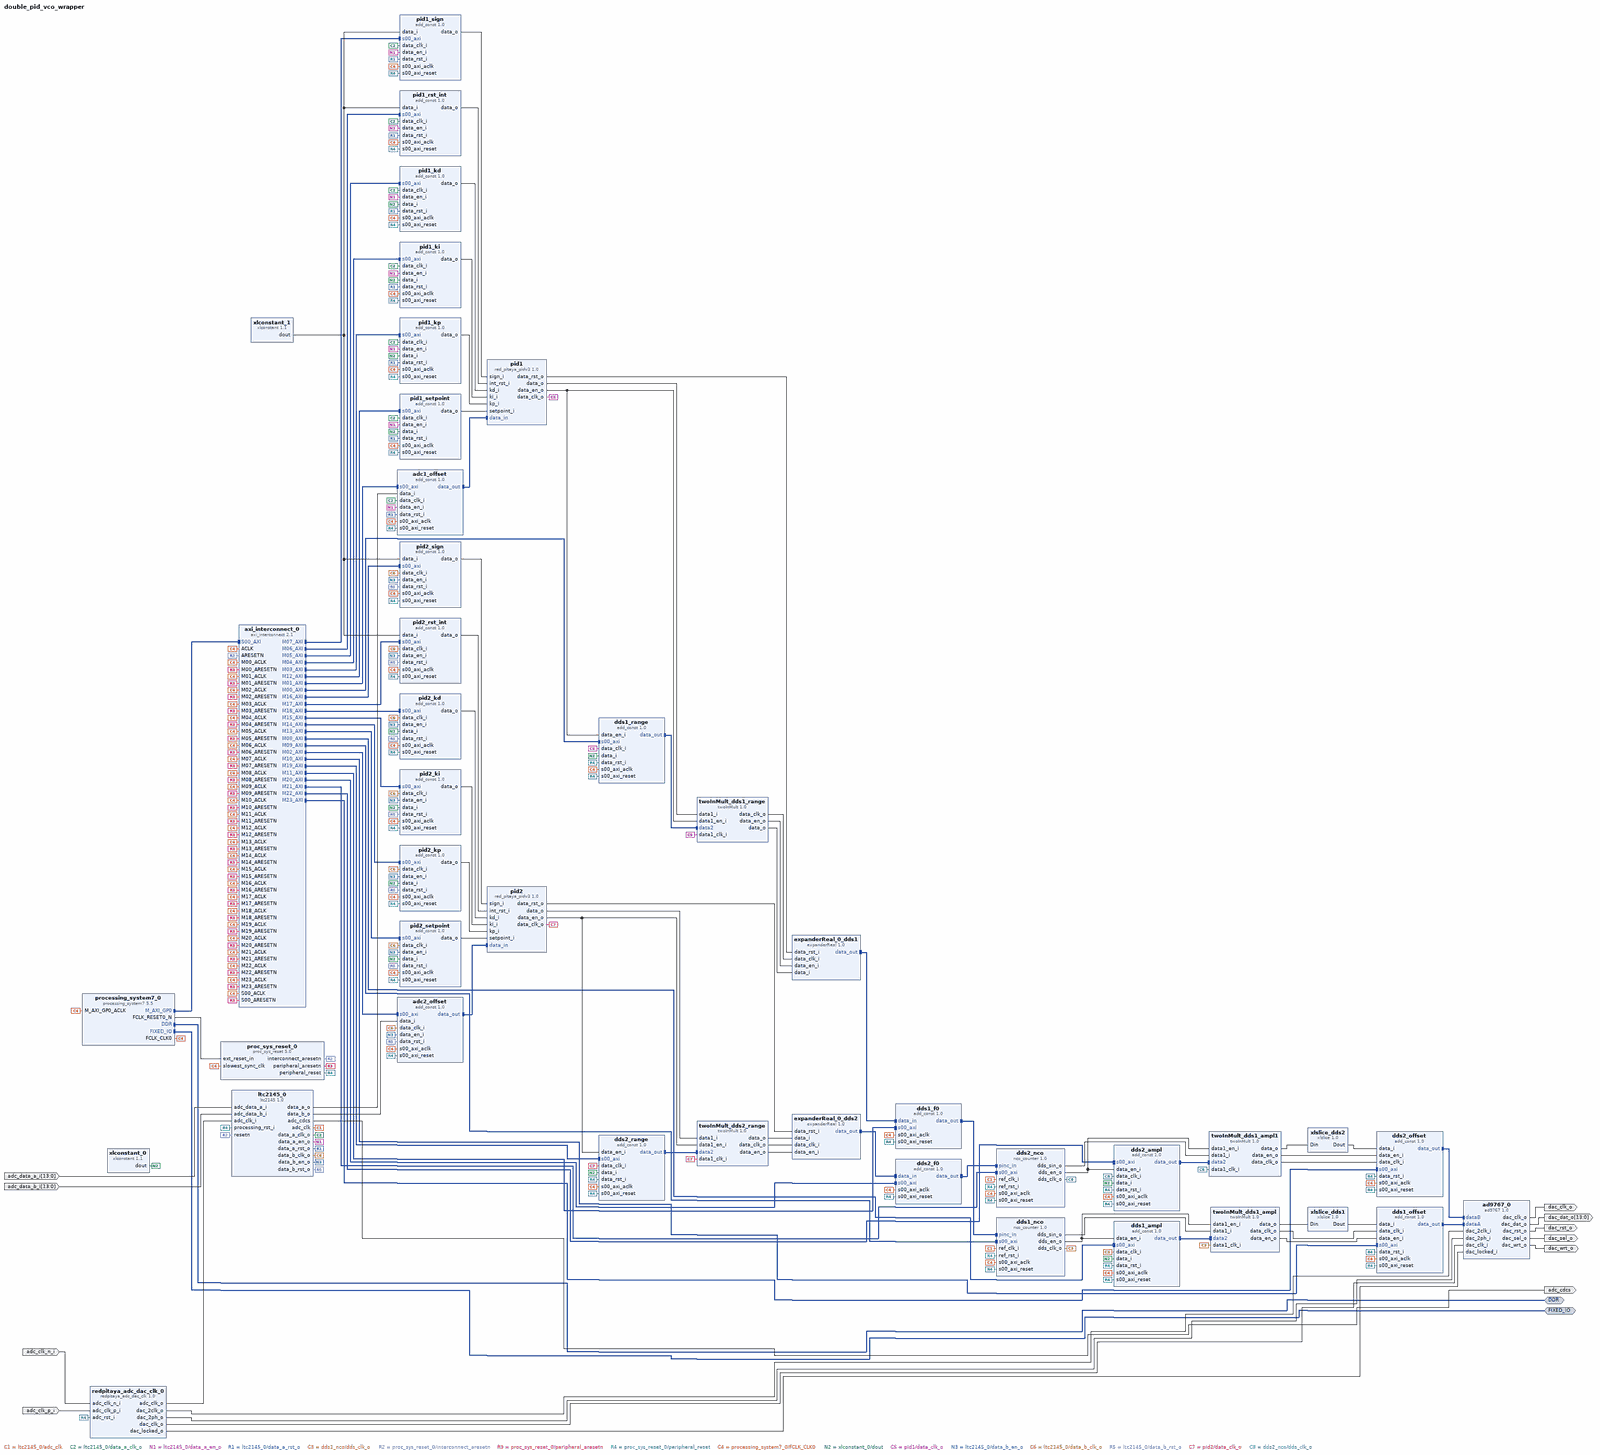
[diagram p0: block diagram of the top level, whole]
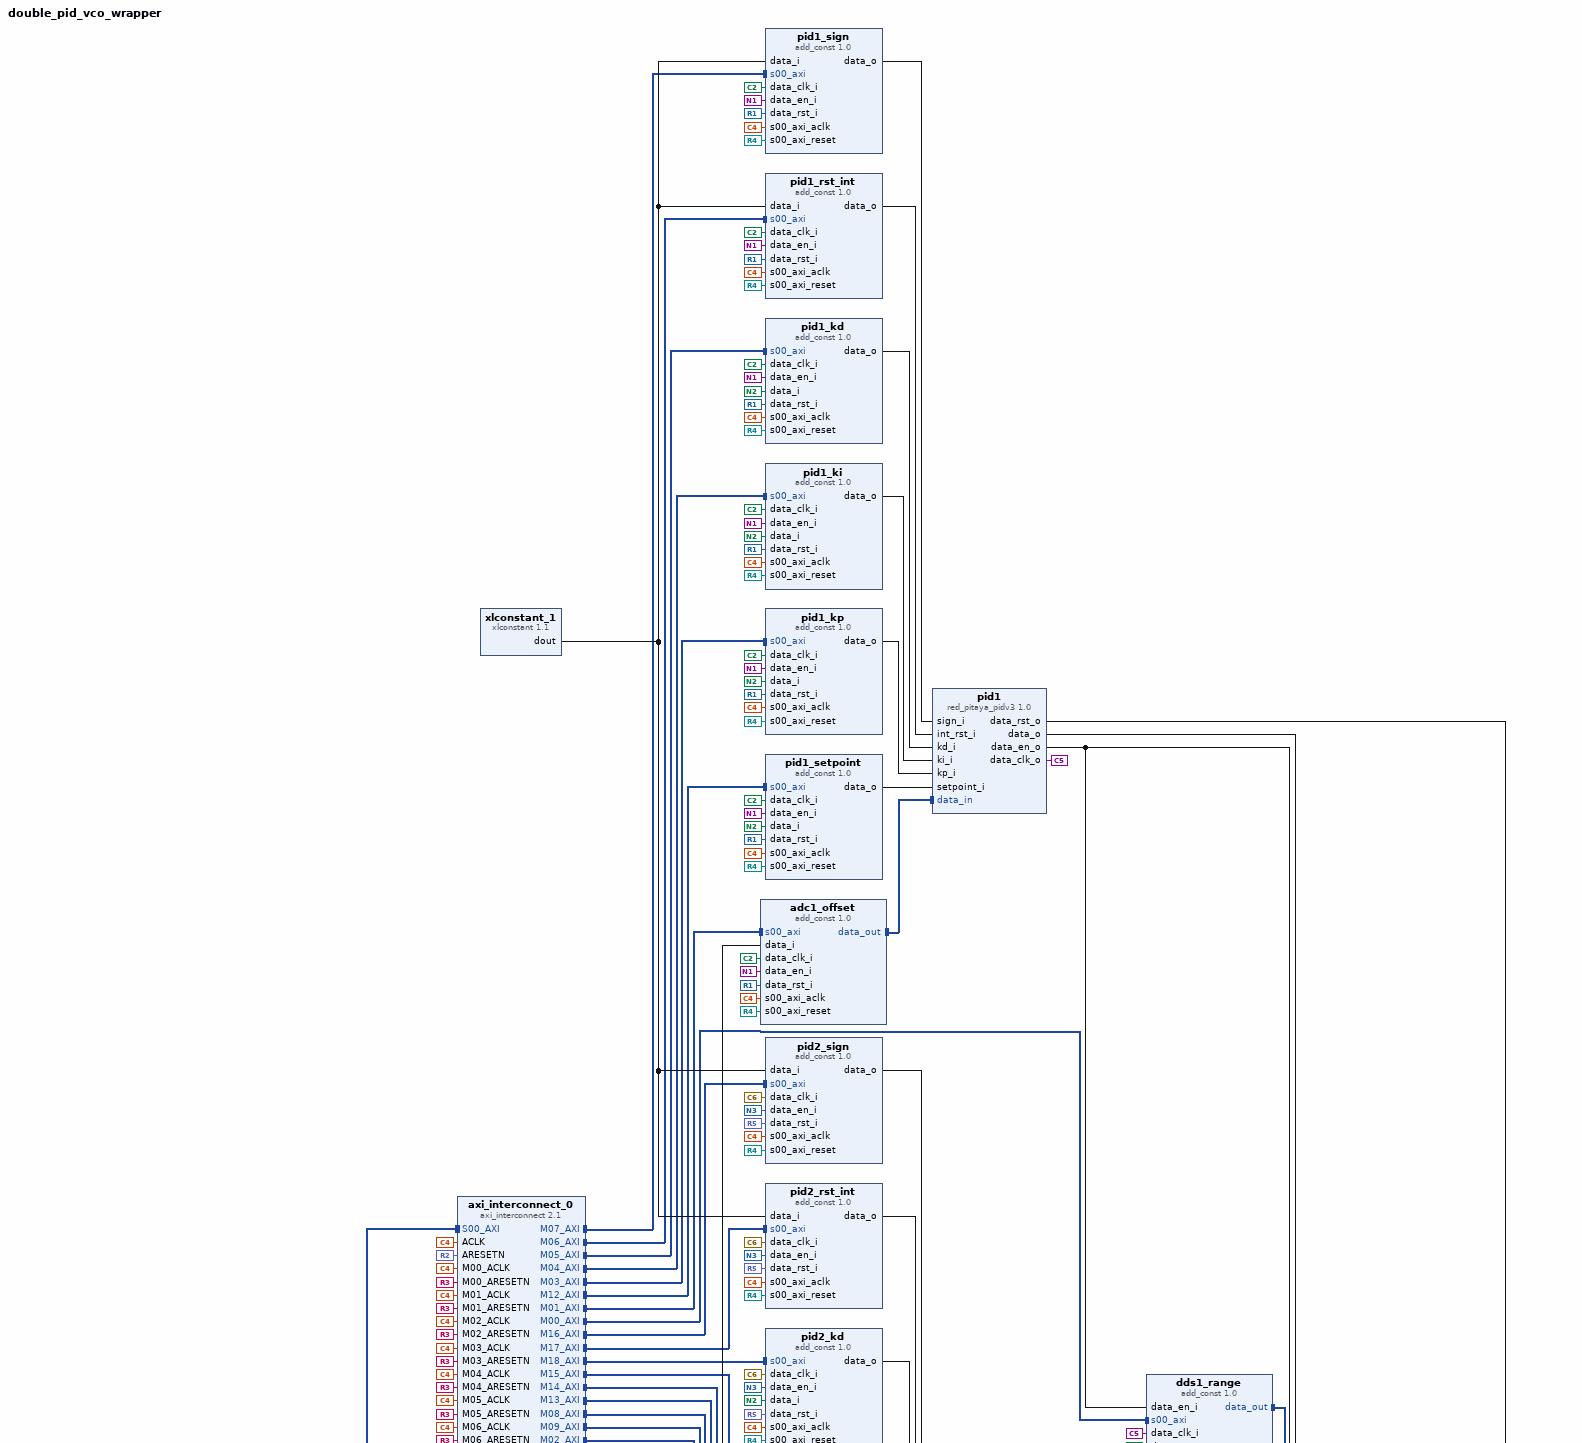
[diagram p1: block diagram of the top level, upper left part]
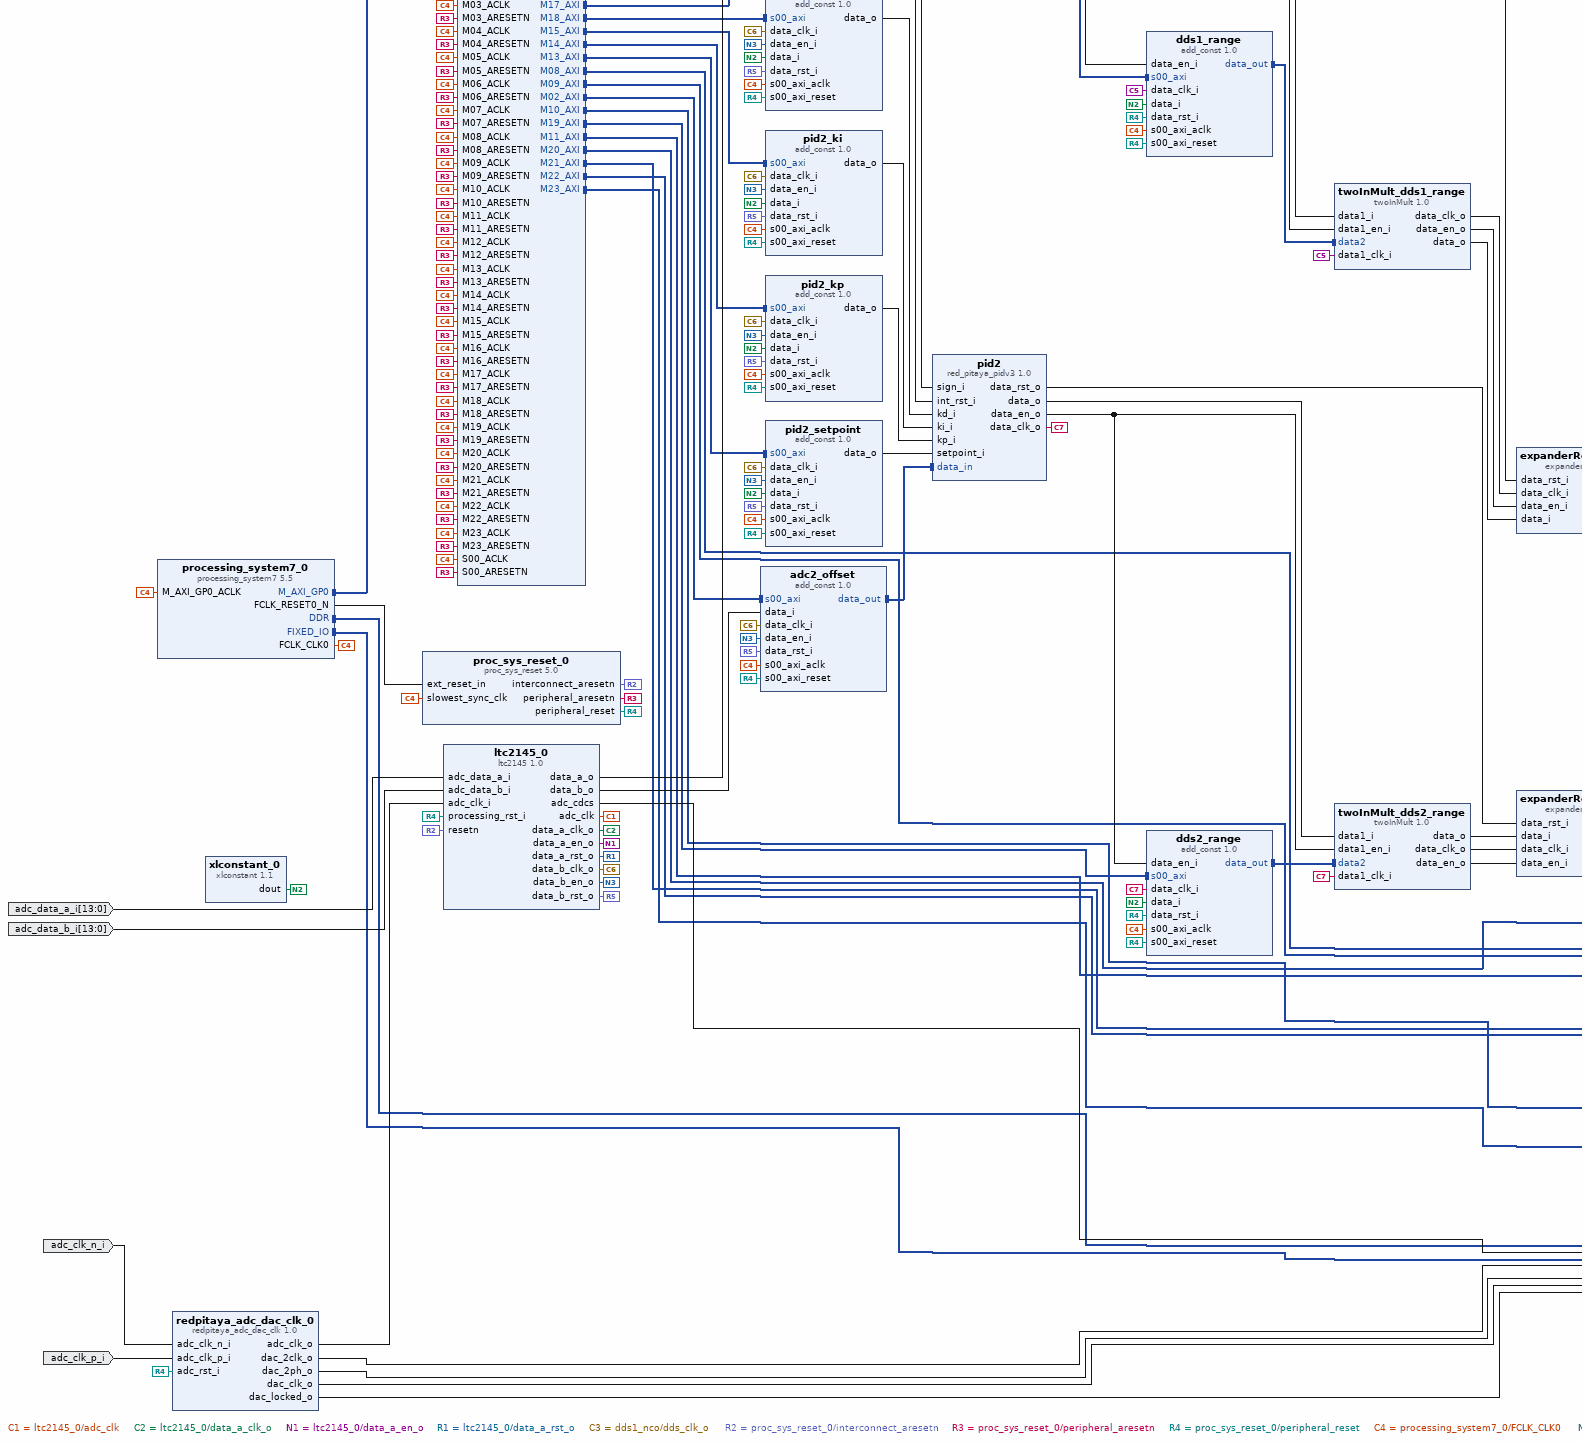
[diagram p2: block diagram of the top level, lower left part]
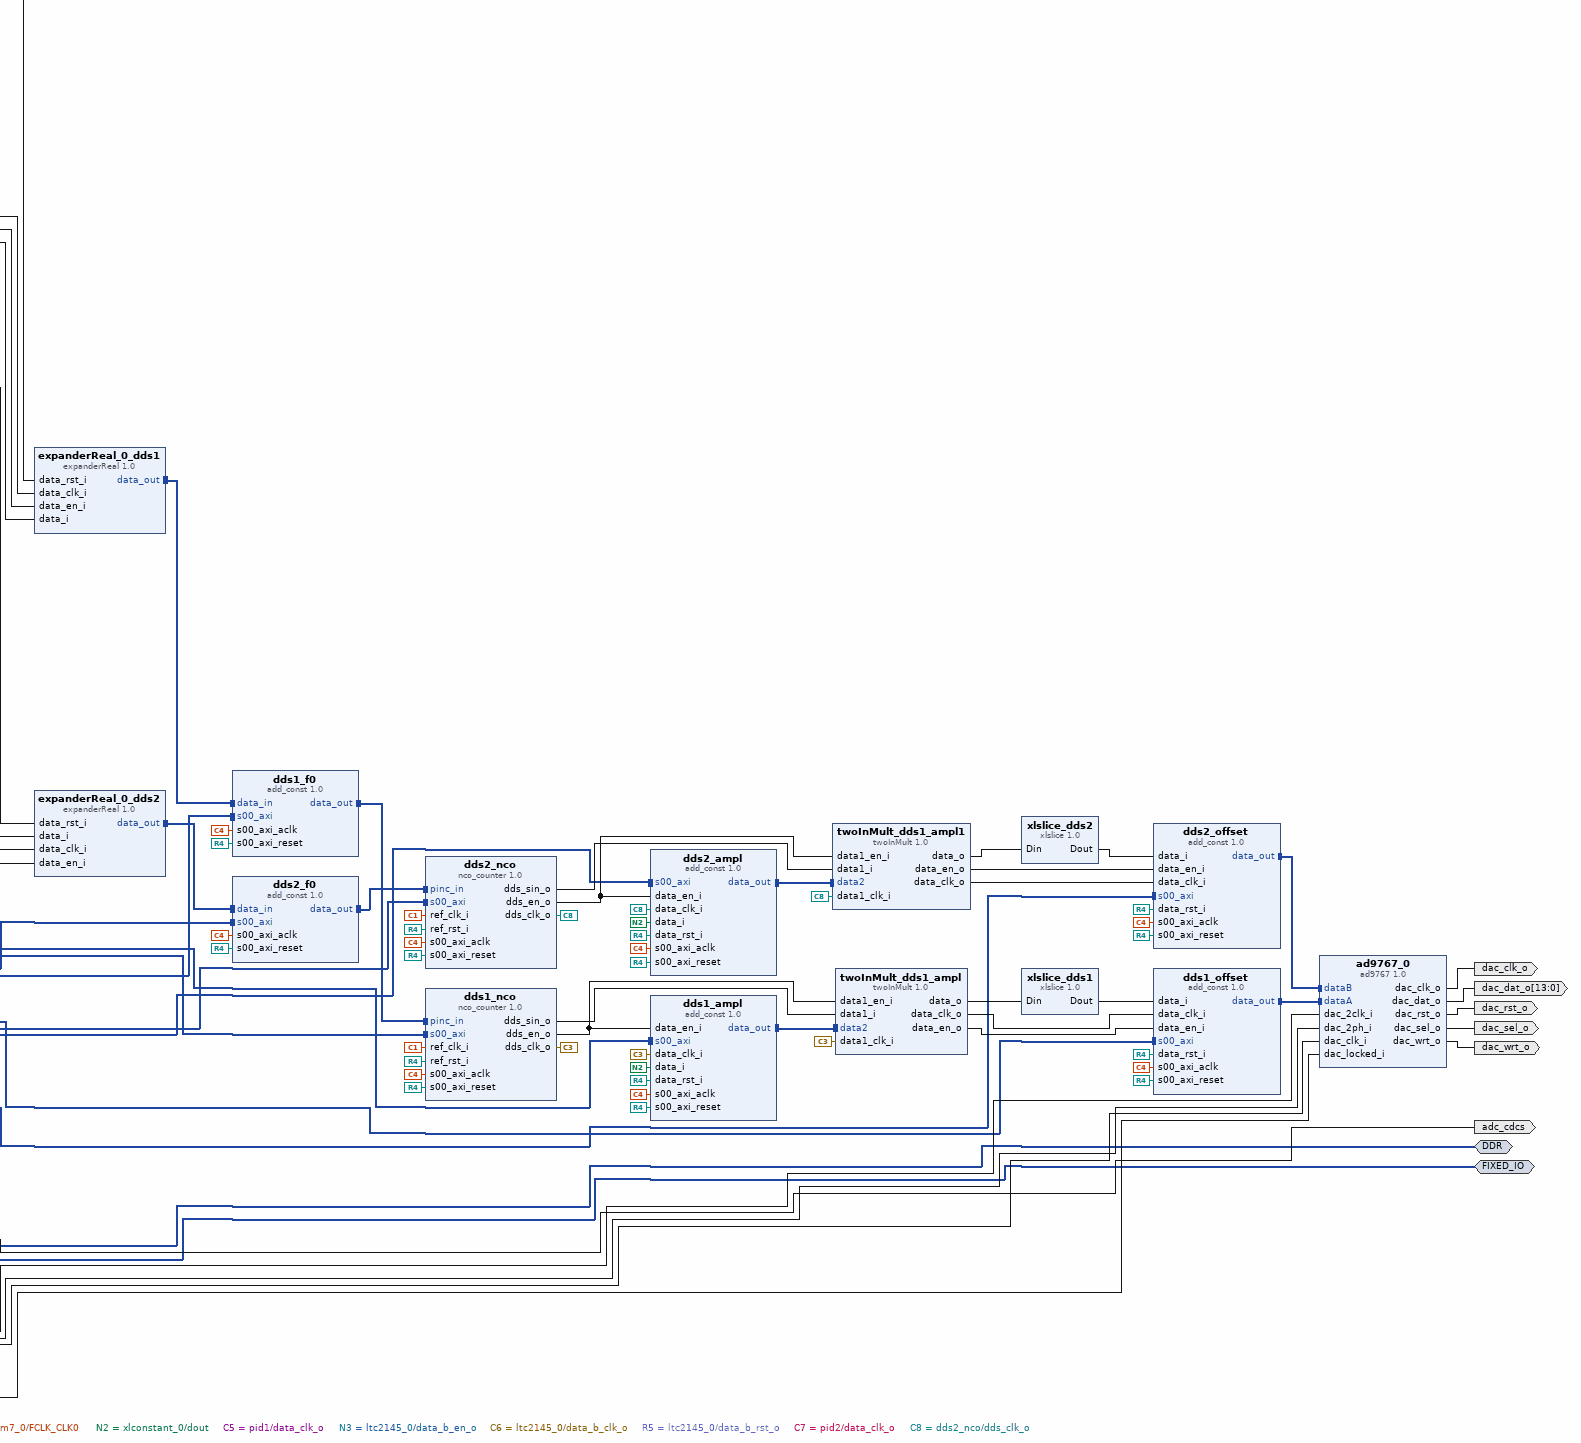
[diagram p3: block diagram of the top level, lower right part]
# Vivado block design double_pid_vco_wrapper, xc7z010clg400-1, Vivado 2016.4
create_bd_design double_pid_vco_wrapper

create_bd_intf_port -mode Master -vlnv xilinx.com:interface:ddrx_rtl:1.0 DDR
create_bd_intf_port -mode Master -vlnv xilinx.com:display_processing_system7:fixedio_rtl:1.0 FIXED_IO
create_bd_port -dir O dac_clk_o
create_bd_port -dir O -from 13 -to 0 dac_dat_o
create_bd_port -dir O dac_rst_o
create_bd_port -dir O dac_sel_o
create_bd_port -dir O dac_wrt_o
create_bd_port -dir I adc_clk_n_i
create_bd_port -dir I adc_clk_p_i
create_bd_port -dir I -from 13 -to 0 adc_data_a_i
create_bd_port -dir I -from 13 -to 0 adc_data_b_i
create_bd_port -dir O adc_cdcs

create_bd_cell -type ip -vlnv ggm:cogen:ad9767:1.0 ad9767_0
create_bd_cell -type ip -vlnv ggm:cogen:add_const:1.0 adc1_offset
set_property -dict {CONFIG.DATA_OUT_SIZE 14 CONFIG.DATA_IN_SIZE 14} [get_bd_cells adc1_offset]
create_bd_cell -type ip -vlnv xilinx.com:ip:axi_interconnect:2.1 axi_interconnect_0
set_property -dict {CONFIG.NUM_MI 24} [get_bd_cells axi_interconnect_0]
create_bd_cell -type ip -vlnv ggm:cogen:add_const:1.0 dds1_ampl
set_property -dict {CONFIG.format unsigned CONFIG.DATA_OUT_SIZE 14 CONFIG.DATA_IN_SIZE 14} [get_bd_cells dds1_ampl]
create_bd_cell -type ip -vlnv ggm:cogen:add_const:1.0 dds1_f0
set_property -dict {CONFIG.format unsigned CONFIG.DATA_OUT_SIZE 32 CONFIG.DATA_IN_SIZE 32} [get_bd_cells dds1_f0]
create_bd_cell -type ip -vlnv ggm:cogen:add_const:1.0 dds1_offset
set_property -dict {CONFIG.DATA_OUT_SIZE 14 CONFIG.DATA_IN_SIZE 14} [get_bd_cells dds1_offset]
create_bd_cell -type ip -vlnv ggm:cogen:add_const:1.0 dds1_range
set_property -dict {CONFIG.format signed CONFIG.DATA_OUT_SIZE 14 CONFIG.DATA_IN_SIZE 14} [get_bd_cells dds1_range]
create_bd_cell -type ip -vlnv ggm:cogen:expanderReal:1.0 expanderReal_0_dds1
set_property -dict {CONFIG.format signed CONFIG.DATA_IN_SIZE 28 CONFIG.DATA_OUT_SIZE 32} [get_bd_cells expanderReal_0_dds1]
create_bd_cell -type ip -vlnv ggm:cogen:add_const:1.0 pid1_kd
set_property -dict {CONFIG.format unsigned CONFIG.DATA_OUT_SIZE 14 CONFIG.DATA_IN_SIZE 14} [get_bd_cells pid1_kd]
create_bd_cell -type ip -vlnv ggm:cogen:add_const:1.0 pid1_ki
set_property -dict {CONFIG.format unsigned CONFIG.DATA_OUT_SIZE 14 CONFIG.DATA_IN_SIZE 14} [get_bd_cells pid1_ki]
create_bd_cell -type ip -vlnv ggm:cogen:add_const:1.0 pid1_kp
set_property -dict [list \
  CONFIG.format unsigned \
  CONFIG.DATA_OUT_SIZE 14 \
  CONFIG.DATA_IN_SIZE 14 \
  CONFIG.C_S00_AXI_DATA_WIDTH 32 \
] [get_bd_cells pid1_kp]
create_bd_cell -type ip -vlnv ggm:cogen:add_const:1.0 pid1_rst_int
set_property -dict {CONFIG.format unsigned CONFIG.DATA_OUT_SIZE 1 CONFIG.DATA_IN_SIZE 1} [get_bd_cells pid1_rst_int]
create_bd_cell -type ip -vlnv ggm:cogen:add_const:1.0 pid1_setpoint
set_property -dict {CONFIG.format signed CONFIG.DATA_OUT_SIZE 14 CONFIG.DATA_IN_SIZE 14} [get_bd_cells pid1_setpoint]
create_bd_cell -type ip -vlnv ggm:cogen:add_const:1.0 pid1_sign
set_property -dict {CONFIG.format unsigned CONFIG.DATA_OUT_SIZE 1 CONFIG.DATA_IN_SIZE 1} [get_bd_cells pid1_sign]
create_bd_cell -type ip -vlnv xilinx.com:ip:proc_sys_reset:5.0 proc_sys_reset_0
create_bd_cell -type ip -vlnv xilinx.com:ip:processing_system7:5.5 processing_system7_0
set_property -dict [list \
  CONFIG.PCW_FCLK_CLK1_BUF TRUE \
  CONFIG.PCW_FCLK_CLK2_BUF TRUE \
  CONFIG.PCW_FCLK_CLK3_BUF TRUE \
  CONFIG.PCW_UIPARAM_DDR_FREQ_MHZ 533.333333 \
  CONFIG.PCW_APU_PERIPHERAL_FREQMHZ 666.666666 \
  CONFIG.PCW_QSPI_PERIPHERAL_FREQMHZ 125 \
  CONFIG.PCW_SDIO_PERIPHERAL_FREQMHZ 125 \
  CONFIG.PCW_UART_PERIPHERAL_FREQMHZ 100 \
  CONFIG.PCW_I2C_PERIPHERAL_FREQMHZ 111.111115 \
  CONFIG.PCW_FPGA0_PERIPHERAL_FREQMHZ 125 \
  CONFIG.PCW_FPGA1_PERIPHERAL_FREQMHZ 250 \
  CONFIG.PCW_FPGA3_PERIPHERAL_FREQMHZ 200 \
  CONFIG.PCW_M_AXI_GP0_FREQMHZ 125 \
  CONFIG.PCW_EN_CLK1_PORT 1 \
  CONFIG.PCW_EN_CLK2_PORT 1 \
  CONFIG.PCW_EN_CLK3_PORT 1 \
  CONFIG.PCW_EN_RST1_PORT 1 \
  CONFIG.PCW_EN_RST2_PORT 1 \
  CONFIG.PCW_EN_RST3_PORT 1 \
  CONFIG.PCW_IRQ_F2P_MODE REVERSE \
  CONFIG.PCW_PERIPHERAL_BOARD_PRESET part0 \
  CONFIG.PCW_PRESET_BANK1_VOLTAGE {LVCMOS 2.5V} \
  CONFIG.PCW_UIPARAM_DDR_BUS_WIDTH {16 Bit} \
  CONFIG.PCW_UIPARAM_DDR_PARTNO {MT41J256M16 RE-125} \
  CONFIG.PCW_QSPI_PERIPHERAL_ENABLE 1 \
  CONFIG.PCW_QSPI_QSPI_IO {MIO 1 .. 6} \
  CONFIG.PCW_QSPI_GRP_SINGLE_SS_ENABLE 1 \
  CONFIG.PCW_QSPI_GRP_SINGLE_SS_IO {MIO 1 .. 6} \
  CONFIG.PCW_ENET0_PERIPHERAL_ENABLE 1 \
  CONFIG.PCW_ENET0_ENET0_IO {MIO 16 .. 27} \
  CONFIG.PCW_ENET0_GRP_MDIO_ENABLE 1 \
  CONFIG.PCW_ENET0_GRP_MDIO_IO {MIO 52 .. 53} \
  CONFIG.PCW_ENET_RESET_ENABLE 1 \
  CONFIG.PCW_ENET_RESET_SELECT {Share reset pin} \
  CONFIG.PCW_ENET0_RESET_ENABLE 0 \
  CONFIG.PCW_SD0_PERIPHERAL_ENABLE 1 \
  CONFIG.PCW_SD0_SD0_IO {MIO 40 .. 45} \
  CONFIG.PCW_SD0_GRP_CD_ENABLE 1 \
  CONFIG.PCW_SD0_GRP_CD_IO {MIO 46} \
  CONFIG.PCW_SD0_GRP_WP_ENABLE 1 \
  CONFIG.PCW_SD0_GRP_WP_IO {MIO 47} \
  CONFIG.PCW_UART0_PERIPHERAL_ENABLE 1 \
  CONFIG.PCW_UART0_UART0_IO {MIO 14 .. 15} \
  CONFIG.PCW_UART1_PERIPHERAL_ENABLE 1 \
  CONFIG.PCW_UART1_UART1_IO {MIO 8 .. 9} \
  CONFIG.PCW_SPI0_PERIPHERAL_ENABLE 1 \
  CONFIG.PCW_SPI0_SPI0_IO EMIO \
  CONFIG.PCW_SPI1_PERIPHERAL_ENABLE 1 \
  CONFIG.PCW_SPI1_SPI1_IO {MIO 10 .. 15} \
  CONFIG.PCW_TRACE_INTERNAL_WIDTH 32 \
  CONFIG.PCW_TTC0_PERIPHERAL_ENABLE 1 \
  CONFIG.PCW_TTC0_TTC0_IO EMIO \
  CONFIG.PCW_USB0_PERIPHERAL_ENABLE 1 \
  CONFIG.PCW_USB0_USB0_IO {MIO 28 .. 39} \
  CONFIG.PCW_USB_RESET_ENABLE 1 \
  CONFIG.PCW_USB_RESET_SELECT {Share reset pin} \
  CONFIG.PCW_USB0_RESET_ENABLE 1 \
  CONFIG.PCW_USB0_RESET_IO {MIO 48} \
  CONFIG.PCW_I2C0_PERIPHERAL_ENABLE 1 \
  CONFIG.PCW_I2C0_I2C0_IO {MIO 50 .. 51} \
  CONFIG.PCW_I2C0_GRP_INT_ENABLE 0 \
  CONFIG.PCW_I2C_RESET_ENABLE 1 \
  CONFIG.PCW_I2C_RESET_SELECT {Share reset pin} \
  CONFIG.PCW_GPIO_MIO_GPIO_ENABLE 1 \
  CONFIG.PCW_GPIO_MIO_GPIO_IO MIO \
  CONFIG.PCW_DCI_PERIPHERAL_CLKSRC 1 \
  CONFIG.PCW_PCAP_PERIPHERAL_CLKSRC 1 \
  CONFIG.PCW_FPGA_FCLK1_ENABLE 1 \
  CONFIG.PCW_FPGA_FCLK2_ENABLE 1 \
  CONFIG.PCW_FPGA_FCLK3_ENABLE 1 \
] [get_bd_cells processing_system7_0]
# 490 more settings of processing_system7_0 are not shown: defaults, MIO pin electricals, DDR timing, and values the tool derives
create_bd_cell -type ip -vlnv ggm:cogen:redpitaya_adc_dac_clk:1.0 redpitaya_adc_dac_clk_0
create_bd_cell -type ip -vlnv ggm:cogen:twoInMult:1.0 twoInMult_dds1_ampl
set_property -dict {CONFIG.DATA_SIZE 14} [get_bd_cells twoInMult_dds1_ampl]
create_bd_cell -type ip -vlnv ggm:cogen:twoInMult:1.0 twoInMult_dds1_range
set_property -dict {CONFIG.format signed CONFIG.DATA_SIZE 14} [get_bd_cells twoInMult_dds1_range]
create_bd_cell -type ip -vlnv xilinx.com:ip:xlconstant:1.1 xlconstant_0
set_property -dict {CONFIG.CONST_WIDTH 14 CONFIG.CONST_VAL 0} [get_bd_cells xlconstant_0]
create_bd_cell -type ip -vlnv xilinx.com:ip:xlconstant:1.1 xlconstant_1
set_property -dict {CONFIG.CONST_VAL 0} [get_bd_cells xlconstant_1]
create_bd_cell -type ip -vlnv xilinx.com:ip:xlslice:1.0 xlslice_dds1
set_property -dict {CONFIG.DOUT_WIDTH 14 CONFIG.DIN_TO 13 CONFIG.DIN_FROM 26 CONFIG.DIN_WIDTH 28} [get_bd_cells xlslice_dds1]
create_bd_cell -type ip -vlnv ggm:cogen:add_const:1.0 adc2_offset
set_property -dict {CONFIG.DATA_OUT_SIZE 14 CONFIG.DATA_IN_SIZE 14} [get_bd_cells adc2_offset]
create_bd_cell -type ip -vlnv ggm:cogen:add_const:1.0 pid2_setpoint
set_property -dict {CONFIG.format signed CONFIG.DATA_OUT_SIZE 14 CONFIG.DATA_IN_SIZE 14} [get_bd_cells pid2_setpoint]
create_bd_cell -type ip -vlnv ggm:cogen:add_const:1.0 pid2_kp
set_property -dict [list \
  CONFIG.format unsigned \
  CONFIG.DATA_OUT_SIZE 14 \
  CONFIG.DATA_IN_SIZE 14 \
  CONFIG.C_S00_AXI_DATA_WIDTH 32 \
] [get_bd_cells pid2_kp]
create_bd_cell -type ip -vlnv ggm:cogen:add_const:1.0 pid2_ki
set_property -dict {CONFIG.format unsigned CONFIG.DATA_OUT_SIZE 14 CONFIG.DATA_IN_SIZE 14} [get_bd_cells pid2_ki]
create_bd_cell -type ip -vlnv ggm:cogen:add_const:1.0 pid2_sign
set_property -dict {CONFIG.format unsigned CONFIG.DATA_OUT_SIZE 1 CONFIG.DATA_IN_SIZE 1} [get_bd_cells pid2_sign]
create_bd_cell -type ip -vlnv ggm:cogen:add_const:1.0 pid2_rst_int
set_property -dict {CONFIG.format unsigned CONFIG.DATA_OUT_SIZE 1 CONFIG.DATA_IN_SIZE 1} [get_bd_cells pid2_rst_int]
create_bd_cell -type ip -vlnv ggm:cogen:add_const:1.0 pid2_kd
set_property -dict {CONFIG.format unsigned CONFIG.DATA_OUT_SIZE 14 CONFIG.DATA_IN_SIZE 14} [get_bd_cells pid2_kd]
create_bd_cell -type ip -vlnv ggm:cogen:twoInMult:1.0 twoInMult_dds2_range
set_property -dict {CONFIG.format signed CONFIG.DATA_SIZE 14} [get_bd_cells twoInMult_dds2_range]
create_bd_cell -type ip -vlnv ggm:cogen:add_const:1.0 dds2_range
set_property -dict {CONFIG.format signed CONFIG.DATA_OUT_SIZE 14 CONFIG.DATA_IN_SIZE 14} [get_bd_cells dds2_range]
create_bd_cell -type ip -vlnv ggm:cogen:expanderReal:1.0 expanderReal_0_dds2
set_property -dict {CONFIG.format signed CONFIG.DATA_IN_SIZE 28 CONFIG.DATA_OUT_SIZE 32} [get_bd_cells expanderReal_0_dds2]
create_bd_cell -type ip -vlnv ggm:cogen:add_const:1.0 dds2_f0
set_property -dict {CONFIG.format unsigned CONFIG.DATA_OUT_SIZE 32 CONFIG.DATA_IN_SIZE 32} [get_bd_cells dds2_f0]
create_bd_cell -type ip -vlnv ggm:cogen:twoInMult:1.0 twoInMult_dds1_ampl1
set_property -dict {CONFIG.DATA_SIZE 14} [get_bd_cells twoInMult_dds1_ampl1]
create_bd_cell -type ip -vlnv ggm:cogen:add_const:1.0 dds2_ampl
set_property -dict {CONFIG.format unsigned CONFIG.DATA_OUT_SIZE 14 CONFIG.DATA_IN_SIZE 14} [get_bd_cells dds2_ampl]
create_bd_cell -type ip -vlnv xilinx.com:ip:xlslice:1.0 xlslice_dds2
set_property -dict {CONFIG.DOUT_WIDTH 14 CONFIG.DIN_TO 13 CONFIG.DIN_FROM 26 CONFIG.DIN_WIDTH 28} [get_bd_cells xlslice_dds2]
create_bd_cell -type ip -vlnv ggm:cogen:add_const:1.0 dds2_offset
set_property -dict {CONFIG.DATA_OUT_SIZE 14 CONFIG.DATA_IN_SIZE 14} [get_bd_cells dds2_offset]
create_bd_cell -type ip -vlnv user.org:user:nco_counter:1.0 dds2_nco
set_property -dict {CONFIG.DATA_SIZE 14 CONFIG.COUNTER_SIZE 32 CONFIG.LUT_SIZE 12} [get_bd_cells dds2_nco]
create_bd_cell -type ip -vlnv user.org:user:nco_counter:1.0 dds1_nco
set_property -dict {CONFIG.DATA_SIZE 14 CONFIG.COUNTER_SIZE 32 CONFIG.LUT_SIZE 12} [get_bd_cells dds1_nco]
create_bd_cell -type ip -vlnv gwbs:user:ltc2145:1.0 ltc2145_0
create_bd_cell -type ip -vlnv user.org:user:red_pitaya_pidv3:1.0 pid1
set_property -dict [list \
  CONFIG.PSR 13 \
  CONFIG.ISR 19 \
  CONFIG.DSR 0 \
  CONFIG.P_SIZE 14 \
  CONFIG.I_SIZE 18 \
  CONFIG.D_SIZE 14 \
  CONFIG.DATA_OUT_SIZE 14 \
] [get_bd_cells pid1]
create_bd_cell -type ip -vlnv user.org:user:red_pitaya_pidv3:1.0 pid2
set_property -dict [list \
  CONFIG.PSR 13 \
  CONFIG.ISR 19 \
  CONFIG.DSR 0 \
  CONFIG.P_SIZE 14 \
  CONFIG.I_SIZE 18 \
  CONFIG.D_SIZE 14 \
  CONFIG.DATA_OUT_SIZE 14 \
] [get_bd_cells pid2]

# ---- connections ----

connect_bd_intf_net [get_bd_intf_pins pid1/data_in] [get_bd_intf_pins adc1_offset/data_out]
connect_bd_intf_net [get_bd_intf_pins axi_interconnect_0/M00_AXI] [get_bd_intf_pins dds1_range/s00_axi]
connect_bd_intf_net [get_bd_intf_pins axi_interconnect_0/M01_AXI] [get_bd_intf_pins adc1_offset/s00_axi]
connect_bd_intf_net [get_bd_intf_pins axi_interconnect_0/M03_AXI] [get_bd_intf_pins pid1_kp/s00_axi]
connect_bd_intf_net [get_bd_intf_pins axi_interconnect_0/M04_AXI] [get_bd_intf_pins pid1_ki/s00_axi]
connect_bd_intf_net [get_bd_intf_pins axi_interconnect_0/M05_AXI] [get_bd_intf_pins pid1_kd/s00_axi]
connect_bd_intf_net [get_bd_intf_pins axi_interconnect_0/M06_AXI] [get_bd_intf_pins pid1_rst_int/s00_axi]
connect_bd_intf_net [get_bd_intf_pins axi_interconnect_0/M07_AXI] [get_bd_intf_pins pid1_sign/s00_axi]
connect_bd_intf_net [get_bd_intf_pins axi_interconnect_0/M08_AXI] [get_bd_intf_pins dds1_ampl/s00_axi]
connect_bd_intf_net [get_bd_intf_pins axi_interconnect_0/M09_AXI] [get_bd_intf_pins dds1_nco/s00_axi]
connect_bd_intf_net [get_bd_intf_pins axi_interconnect_0/M10_AXI] [get_bd_intf_pins dds1_offset/s00_axi]
connect_bd_intf_net [get_bd_intf_pins axi_interconnect_0/M11_AXI] [get_bd_intf_pins dds1_f0/s00_axi]
connect_bd_intf_net [get_bd_intf_pins axi_interconnect_0/M12_AXI] [get_bd_intf_pins pid1_setpoint/s00_axi]
connect_bd_intf_net -intf_net dds_ampl_data_out [get_bd_intf_pins twoInMult_dds1_ampl/data2] [get_bd_intf_pins dds1_ampl/data_out]
connect_bd_intf_net -intf_net dds_f0_data_out [get_bd_intf_pins dds1_nco/pinc_in] [get_bd_intf_pins dds1_f0/data_out]
connect_bd_intf_net -intf_net dds_offset_data_out [get_bd_intf_pins dds1_offset/data_out] [get_bd_intf_pins ad9767_0/dataA]
connect_bd_intf_net -intf_net dds_range_data_out [get_bd_intf_pins twoInMult_dds1_range/data2] [get_bd_intf_pins dds1_range/data_out]
connect_bd_intf_net -intf_net expanderReal_0_data_out [get_bd_intf_pins expanderReal_0_dds1/data_out] [get_bd_intf_pins dds1_f0/data_in]
connect_bd_intf_net [get_bd_intf_pins processing_system7_0/M_AXI_GP0] [get_bd_intf_pins axi_interconnect_0/S00_AXI]
connect_bd_intf_net [get_bd_intf_pins axi_interconnect_0/M02_AXI] [get_bd_intf_pins adc2_offset/s00_axi]
connect_bd_intf_net [get_bd_intf_pins pid2/data_in] [get_bd_intf_pins adc2_offset/data_out]
connect_bd_intf_net [get_bd_intf_pins axi_interconnect_0/M13_AXI] [get_bd_intf_pins pid2_setpoint/s00_axi]
connect_bd_intf_net [get_bd_intf_pins axi_interconnect_0/M14_AXI] [get_bd_intf_pins pid2_kp/s00_axi]
connect_bd_intf_net [get_bd_intf_pins axi_interconnect_0/M15_AXI] [get_bd_intf_pins pid2_ki/s00_axi]
connect_bd_intf_net [get_bd_intf_pins axi_interconnect_0/M16_AXI] [get_bd_intf_pins pid2_sign/s00_axi]
connect_bd_intf_net [get_bd_intf_pins axi_interconnect_0/M17_AXI] [get_bd_intf_pins pid2_rst_int/s00_axi]
connect_bd_intf_net [get_bd_intf_pins axi_interconnect_0/M18_AXI] [get_bd_intf_pins pid2_kd/s00_axi]
connect_bd_intf_net [get_bd_intf_pins axi_interconnect_0/M19_AXI] [get_bd_intf_pins dds2_range/s00_axi]
connect_bd_intf_net [get_bd_intf_pins twoInMult_dds2_range/data2] [get_bd_intf_pins dds2_range/data_out]
connect_bd_intf_net [get_bd_intf_pins axi_interconnect_0/M20_AXI] [get_bd_intf_pins dds2_f0/s00_axi]
connect_bd_intf_net [get_bd_intf_pins dds2_f0/data_in] [get_bd_intf_pins expanderReal_0_dds2/data_out]
connect_bd_intf_net [get_bd_intf_pins axi_interconnect_0/M21_AXI] [get_bd_intf_pins dds2_nco/s00_axi]
connect_bd_intf_net [get_bd_intf_pins dds2_f0/data_out] [get_bd_intf_pins dds2_nco/pinc_in]
connect_bd_intf_net [get_bd_intf_pins axi_interconnect_0/M22_AXI] [get_bd_intf_pins dds2_ampl/s00_axi]
connect_bd_intf_net [get_bd_intf_pins dds2_ampl/data_out] [get_bd_intf_pins twoInMult_dds1_ampl1/data2]
connect_bd_intf_net [get_bd_intf_pins axi_interconnect_0/M23_AXI] [get_bd_intf_pins dds2_offset/s00_axi]
connect_bd_intf_net [get_bd_intf_pins dds2_offset/data_out] [get_bd_intf_pins ad9767_0/dataB]
connect_bd_intf_net [get_bd_intf_ports DDR] [get_bd_intf_pins processing_system7_0/DDR]
connect_bd_intf_net [get_bd_intf_ports FIXED_IO] [get_bd_intf_pins processing_system7_0/FIXED_IO]
connect_bd_net [get_bd_pins ad9767_0/dac_clk_o] [get_bd_ports dac_clk_o]
connect_bd_net [get_bd_pins ad9767_0/dac_dat_o] [get_bd_ports dac_dat_o]
connect_bd_net [get_bd_pins ad9767_0/dac_rst_o] [get_bd_ports dac_rst_o]
connect_bd_net [get_bd_pins ad9767_0/dac_sel_o] [get_bd_ports dac_sel_o]
connect_bd_net [get_bd_pins ad9767_0/dac_wrt_o] [get_bd_ports dac_wrt_o]
connect_bd_net [get_bd_ports adc_clk_n_i] [get_bd_pins redpitaya_adc_dac_clk_0/adc_clk_n_i]
connect_bd_net [get_bd_ports adc_clk_p_i] [get_bd_pins redpitaya_adc_dac_clk_0/adc_clk_p_i]
connect_bd_net [get_bd_ports adc_data_a_i] [get_bd_pins ltc2145_0/adc_data_a_i]
connect_bd_net [get_bd_ports adc_data_b_i] [get_bd_pins ltc2145_0/adc_data_b_i]
connect_bd_net [get_bd_pins ltc2145_0/adc_cdcs] [get_bd_ports adc_cdcs]
connect_bd_net [get_bd_pins ltc2145_0/adc_clk] [get_bd_pins dds2_nco/ref_clk_i] [get_bd_pins dds1_nco/ref_clk_i]
connect_bd_net [get_bd_pins ltc2145_0/data_a_clk_o] \
  [get_bd_pins adc1_offset/data_clk_i] [get_bd_pins pid1_kp/data_clk_i] [get_bd_pins pid1_ki/data_clk_i] \
  [get_bd_pins pid1_kd/data_clk_i] [get_bd_pins pid1_rst_int/data_clk_i] [get_bd_pins pid1_sign/data_clk_i] \
  [get_bd_pins pid1_setpoint/data_clk_i]
connect_bd_net [get_bd_pins ltc2145_0/data_a_en_o] \
  [get_bd_pins adc1_offset/data_en_i] [get_bd_pins pid1_kp/data_en_i] [get_bd_pins pid1_ki/data_en_i] \
  [get_bd_pins pid1_kd/data_en_i] [get_bd_pins pid1_rst_int/data_en_i] [get_bd_pins pid1_sign/data_en_i] \
  [get_bd_pins pid1_setpoint/data_en_i]
connect_bd_net [get_bd_pins ltc2145_0/data_a_o] [get_bd_pins adc1_offset/data_i]
connect_bd_net [get_bd_pins ltc2145_0/data_a_rst_o] \
  [get_bd_pins adc1_offset/data_rst_i] [get_bd_pins pid1_kp/data_rst_i] [get_bd_pins pid1_ki/data_rst_i] \
  [get_bd_pins pid1_kd/data_rst_i] [get_bd_pins pid1_rst_int/data_rst_i] [get_bd_pins pid1_sign/data_rst_i] \
  [get_bd_pins pid1_setpoint/data_rst_i]
connect_bd_net -net nco_counter_0_dds_clk_o [get_bd_pins dds1_nco/dds_clk_o] \
  [get_bd_pins dds1_ampl/data_clk_i] [get_bd_pins twoInMult_dds1_ampl/data1_clk_i]
connect_bd_net -net nco_counter_0_dds_en_o [get_bd_pins dds1_nco/dds_en_o] \
  [get_bd_pins dds1_ampl/data_en_i] [get_bd_pins twoInMult_dds1_ampl/data1_en_i]
connect_bd_net -net nco_counter_0_dds_sin_o [get_bd_pins dds1_nco/dds_sin_o] [get_bd_pins twoInMult_dds1_ampl/data1_i]
connect_bd_net -net pid_kd_data_o [get_bd_pins pid1_kd/data_o] [get_bd_pins pid1/kd_i]
connect_bd_net -net pid_ki_data_o [get_bd_pins pid1_ki/data_o] [get_bd_pins pid1/ki_i]
connect_bd_net -net pid_kp_data_o [get_bd_pins pid1_kp/data_o] [get_bd_pins pid1/kp_i]
connect_bd_net -net pid_rst_int_data_o [get_bd_pins pid1_rst_int/data_o] [get_bd_pins pid1/int_rst_i]
connect_bd_net -net pid_setpoint_data_o [get_bd_pins pid1_setpoint/data_o] [get_bd_pins pid1/setpoint_i]
connect_bd_net -net pid_sign_data_o [get_bd_pins pid1_sign/data_o] [get_bd_pins pid1/sign_i]
connect_bd_net [get_bd_pins proc_sys_reset_0/interconnect_aresetn] [get_bd_pins ltc2145_0/resetn] [get_bd_pins axi_interconnect_0/ARESETN]
connect_bd_net [get_bd_pins proc_sys_reset_0/peripheral_aresetn] \
  [get_bd_pins axi_interconnect_0/S00_ARESETN] [get_bd_pins axi_interconnect_0/M00_ARESETN] \
  [get_bd_pins axi_interconnect_0/M01_ARESETN] [get_bd_pins axi_interconnect_0/M02_ARESETN] \
  [get_bd_pins axi_interconnect_0/M03_ARESETN] [get_bd_pins axi_interconnect_0/M04_ARESETN] \
  [get_bd_pins axi_interconnect_0/M05_ARESETN] [get_bd_pins axi_interconnect_0/M06_ARESETN] \
  [get_bd_pins axi_interconnect_0/M07_ARESETN] [get_bd_pins axi_interconnect_0/M08_ARESETN] \
  [get_bd_pins axi_interconnect_0/M09_ARESETN] [get_bd_pins axi_interconnect_0/M10_ARESETN] \
  [get_bd_pins axi_interconnect_0/M11_ARESETN] [get_bd_pins axi_interconnect_0/M12_ARESETN] \
  [get_bd_pins axi_interconnect_0/M13_ARESETN] [get_bd_pins axi_interconnect_0/M14_ARESETN] \
  [get_bd_pins axi_interconnect_0/M15_ARESETN] [get_bd_pins axi_interconnect_0/M16_ARESETN] \
  [get_bd_pins axi_interconnect_0/M17_ARESETN] [get_bd_pins axi_interconnect_0/M18_ARESETN] \
  [get_bd_pins axi_interconnect_0/M19_ARESETN] [get_bd_pins axi_interconnect_0/M20_ARESETN] \
  [get_bd_pins axi_interconnect_0/M21_ARESETN] [get_bd_pins axi_interconnect_0/M22_ARESETN] \
  [get_bd_pins axi_interconnect_0/M23_ARESETN]
connect_bd_net [get_bd_pins proc_sys_reset_0/peripheral_reset] \
  [get_bd_pins redpitaya_adc_dac_clk_0/adc_rst_i] [get_bd_pins dds1_ampl/s00_axi_reset] \
  [get_bd_pins dds1_offset/s00_axi_reset] [get_bd_pins dds1_offset/data_rst_i] [get_bd_pins dds1_ampl/data_rst_i] \
  [get_bd_pins dds1_f0/s00_axi_reset] [get_bd_pins adc1_offset/s00_axi_reset] [get_bd_pins dds1_range/s00_axi_reset] \
  [get_bd_pins dds1_range/data_rst_i] [get_bd_pins pid1_kp/s00_axi_reset] [get_bd_pins pid1_ki/s00_axi_reset] \
  [get_bd_pins pid1_kd/s00_axi_reset] [get_bd_pins pid1_rst_int/s00_axi_reset] [get_bd_pins pid1_sign/s00_axi_reset] \
  [get_bd_pins pid1_setpoint/s00_axi_reset] [get_bd_pins adc2_offset/s00_axi_reset] [get_bd_pins pid2_setpoint/s00_axi_reset] \
  [get_bd_pins pid2_kp/s00_axi_reset] [get_bd_pins pid2_ki/s00_axi_reset] [get_bd_pins pid2_sign/s00_axi_reset] \
  [get_bd_pins pid2_rst_int/s00_axi_reset] [get_bd_pins pid2_kd/s00_axi_reset] [get_bd_pins dds2_range/s00_axi_reset] \
  [get_bd_pins dds2_range/data_rst_i] [get_bd_pins dds2_f0/s00_axi_reset] [get_bd_pins dds2_ampl/s00_axi_reset] \
  [get_bd_pins dds2_ampl/data_rst_i] [get_bd_pins dds2_offset/s00_axi_reset] [get_bd_pins dds2_offset/data_rst_i] \
  [get_bd_pins dds2_nco/ref_rst_i] [get_bd_pins dds2_nco/s00_axi_reset] [get_bd_pins dds1_nco/ref_rst_i] \
  [get_bd_pins dds1_nco/s00_axi_reset] [get_bd_pins ltc2145_0/processing_rst_i]
connect_bd_net [get_bd_pins processing_system7_0/FCLK_CLK0] \
  [get_bd_pins processing_system7_0/M_AXI_GP0_ACLK] [get_bd_pins proc_sys_reset_0/slowest_sync_clk] \
  [get_bd_pins dds1_ampl/s00_axi_aclk] [get_bd_pins dds1_offset/s00_axi_aclk] [get_bd_pins dds1_f0/s00_axi_aclk] \
  [get_bd_pins adc1_offset/s00_axi_aclk] [get_bd_pins dds1_range/s00_axi_aclk] [get_bd_pins pid1_kp/s00_axi_aclk] \
  [get_bd_pins pid1_ki/s00_axi_aclk] [get_bd_pins pid1_kd/s00_axi_aclk] [get_bd_pins pid1_rst_int/s00_axi_aclk] \
  [get_bd_pins pid1_sign/s00_axi_aclk] [get_bd_pins pid1_setpoint/s00_axi_aclk] [get_bd_pins adc2_offset/s00_axi_aclk] \
  [get_bd_pins pid2_setpoint/s00_axi_aclk] [get_bd_pins pid2_kp/s00_axi_aclk] [get_bd_pins pid2_ki/s00_axi_aclk] \
  [get_bd_pins pid2_sign/s00_axi_aclk] [get_bd_pins pid2_rst_int/s00_axi_aclk] [get_bd_pins pid2_kd/s00_axi_aclk] \
  [get_bd_pins dds2_range/s00_axi_aclk] [get_bd_pins dds2_f0/s00_axi_aclk] [get_bd_pins dds2_ampl/s00_axi_aclk] \
  [get_bd_pins dds2_offset/s00_axi_aclk] [get_bd_pins dds2_nco/s00_axi_aclk] [get_bd_pins dds1_nco/s00_axi_aclk] \
  [get_bd_pins axi_interconnect_0/ACLK] [get_bd_pins axi_interconnect_0/S00_ACLK] [get_bd_pins axi_interconnect_0/M00_ACLK] \
  [get_bd_pins axi_interconnect_0/M01_ACLK] [get_bd_pins axi_interconnect_0/M02_ACLK] \
  [get_bd_pins axi_interconnect_0/M03_ACLK] [get_bd_pins axi_interconnect_0/M04_ACLK] \
  [get_bd_pins axi_interconnect_0/M05_ACLK] [get_bd_pins axi_interconnect_0/M06_ACLK] \
  [get_bd_pins axi_interconnect_0/M07_ACLK] [get_bd_pins axi_interconnect_0/M08_ACLK] \
  [get_bd_pins axi_interconnect_0/M09_ACLK] [get_bd_pins axi_interconnect_0/M10_ACLK] \
  [get_bd_pins axi_interconnect_0/M11_ACLK] [get_bd_pins axi_interconnect_0/M12_ACLK] \
  [get_bd_pins axi_interconnect_0/M13_ACLK] [get_bd_pins axi_interconnect_0/M14_ACLK] \
  [get_bd_pins axi_interconnect_0/M15_ACLK] [get_bd_pins axi_interconnect_0/M16_ACLK] \
  [get_bd_pins axi_interconnect_0/M17_ACLK] [get_bd_pins axi_interconnect_0/M18_ACLK] \
  [get_bd_pins axi_interconnect_0/M19_ACLK] [get_bd_pins axi_interconnect_0/M20_ACLK] \
  [get_bd_pins axi_interconnect_0/M21_ACLK] [get_bd_pins axi_interconnect_0/M22_ACLK] \
  [get_bd_pins axi_interconnect_0/M23_ACLK]
connect_bd_net [get_bd_pins processing_system7_0/FCLK_RESET0_N] [get_bd_pins proc_sys_reset_0/ext_reset_in]
connect_bd_net [get_bd_pins redpitaya_adc_dac_clk_0/adc_clk_o] [get_bd_pins ltc2145_0/adc_clk_i]
connect_bd_net [get_bd_pins redpitaya_adc_dac_clk_0/dac_2clk_o] [get_bd_pins ad9767_0/dac_2clk_i]
connect_bd_net [get_bd_pins redpitaya_adc_dac_clk_0/dac_2ph_o] [get_bd_pins ad9767_0/dac_2ph_i]
connect_bd_net [get_bd_pins redpitaya_adc_dac_clk_0/dac_clk_o] [get_bd_pins ad9767_0/dac_clk_i]
connect_bd_net [get_bd_pins redpitaya_adc_dac_clk_0/dac_locked_o] [get_bd_pins ad9767_0/dac_locked_i]
connect_bd_net -net twoInMult_0_data_clk_o [get_bd_pins twoInMult_dds1_ampl/data_clk_o] [get_bd_pins dds1_offset/data_clk_i]
connect_bd_net -net twoInMult_0_data_en_o [get_bd_pins twoInMult_dds1_ampl/data_en_o] [get_bd_pins dds1_offset/data_en_i]
connect_bd_net -net twoInMult_0_data_o [get_bd_pins twoInMult_dds1_ampl/data_o] [get_bd_pins xlslice_dds1/Din]
connect_bd_net -net twoInMult_dds_range_data_clk_o [get_bd_pins twoInMult_dds1_range/data_clk_o] [get_bd_pins expanderReal_0_dds1/data_clk_i]
connect_bd_net -net twoInMult_dds_range_data_en_o [get_bd_pins twoInMult_dds1_range/data_en_o] [get_bd_pins expanderReal_0_dds1/data_en_i]
connect_bd_net -net twoInMult_dds_range_data_o [get_bd_pins twoInMult_dds1_range/data_o] [get_bd_pins expanderReal_0_dds1/data_i]
connect_bd_net [get_bd_pins xlconstant_0/dout] \
  [get_bd_pins dds1_ampl/data_i] [get_bd_pins dds1_range/data_i] [get_bd_pins pid1_kp/data_i] [get_bd_pins pid1_ki/data_i] \
  [get_bd_pins pid1_kd/data_i] [get_bd_pins pid1_setpoint/data_i] [get_bd_pins pid2_setpoint/data_i] \
  [get_bd_pins pid2_kp/data_i] [get_bd_pins pid2_ki/data_i] [get_bd_pins pid2_kd/data_i] [get_bd_pins dds2_range/data_i] \
  [get_bd_pins dds2_ampl/data_i]
connect_bd_net [get_bd_pins xlconstant_1/dout] \
  [get_bd_pins pid1_rst_int/data_i] [get_bd_pins pid1_sign/data_i] [get_bd_pins pid2_sign/data_i] \
  [get_bd_pins pid2_rst_int/data_i]
connect_bd_net -net xlslice_0_Dout [get_bd_pins xlslice_dds1/Dout] [get_bd_pins dds1_offset/data_i]
connect_bd_net -net red_pitaya_pidv3_0_data_en_o [get_bd_pins pid1/data_en_o] \
  [get_bd_pins twoInMult_dds1_range/data1_en_i] [get_bd_pins dds1_range/data_en_i]
connect_bd_net -net red_pitaya_pidv3_0_data_o [get_bd_pins pid1/data_o] [get_bd_pins twoInMult_dds1_range/data1_i]
connect_bd_net -net red_pitaya_pidv3_0_data_clk_o [get_bd_pins pid1/data_clk_o] \
  [get_bd_pins twoInMult_dds1_range/data1_clk_i] [get_bd_pins dds1_range/data_clk_i]
connect_bd_net -net red_pitaya_pidv3_0_data_rst_o [get_bd_pins pid1/data_rst_o] [get_bd_pins expanderReal_0_dds1/data_rst_i]
connect_bd_net [get_bd_pins ltc2145_0/data_b_o] [get_bd_pins adc2_offset/data_i]
connect_bd_net [get_bd_pins ltc2145_0/data_b_en_o] \
  [get_bd_pins adc2_offset/data_en_i] [get_bd_pins pid2_setpoint/data_en_i] [get_bd_pins pid2_kp/data_en_i] \
  [get_bd_pins pid2_ki/data_en_i] [get_bd_pins pid2_sign/data_en_i] [get_bd_pins pid2_rst_int/data_en_i] \
  [get_bd_pins pid2_kd/data_en_i]
connect_bd_net [get_bd_pins ltc2145_0/data_b_clk_o] \
  [get_bd_pins adc2_offset/data_clk_i] [get_bd_pins pid2_setpoint/data_clk_i] [get_bd_pins pid2_kp/data_clk_i] \
  [get_bd_pins pid2_ki/data_clk_i] [get_bd_pins pid2_sign/data_clk_i] [get_bd_pins pid2_rst_int/data_clk_i] \
  [get_bd_pins pid2_kd/data_clk_i]
connect_bd_net [get_bd_pins ltc2145_0/data_b_rst_o] \
  [get_bd_pins adc2_offset/data_rst_i] [get_bd_pins pid2_setpoint/data_rst_i] [get_bd_pins pid2_kp/data_rst_i] \
  [get_bd_pins pid2_ki/data_rst_i] [get_bd_pins pid2_sign/data_rst_i] [get_bd_pins pid2_rst_int/data_rst_i] \
  [get_bd_pins pid2_kd/data_rst_i]
connect_bd_net [get_bd_pins pid2_setpoint/data_o] [get_bd_pins pid2/setpoint_i]
connect_bd_net [get_bd_pins pid2_kp/data_o] [get_bd_pins pid2/kp_i]
connect_bd_net [get_bd_pins pid2_ki/data_o] [get_bd_pins pid2/ki_i]
connect_bd_net [get_bd_pins pid2_sign/data_o] [get_bd_pins pid2/sign_i]
connect_bd_net [get_bd_pins pid2_rst_int/data_o] [get_bd_pins pid2/int_rst_i]
connect_bd_net [get_bd_pins pid2_kd/data_o] [get_bd_pins pid2/kd_i]
connect_bd_net [get_bd_pins pid2/data_o] [get_bd_pins twoInMult_dds2_range/data1_i]
connect_bd_net [get_bd_pins pid2/data_clk_o] [get_bd_pins twoInMult_dds2_range/data1_clk_i] [get_bd_pins dds2_range/data_clk_i]
connect_bd_net [get_bd_pins pid2/data_en_o] [get_bd_pins twoInMult_dds2_range/data1_en_i] [get_bd_pins dds2_range/data_en_i]
connect_bd_net [get_bd_pins twoInMult_dds2_range/data_o] [get_bd_pins expanderReal_0_dds2/data_i]
connect_bd_net [get_bd_pins twoInMult_dds2_range/data_clk_o] [get_bd_pins expanderReal_0_dds2/data_clk_i]
connect_bd_net [get_bd_pins twoInMult_dds2_range/data_en_o] [get_bd_pins expanderReal_0_dds2/data_en_i]
connect_bd_net [get_bd_pins pid2/data_rst_o] [get_bd_pins expanderReal_0_dds2/data_rst_i]
connect_bd_net [get_bd_pins dds2_nco/dds_sin_o] [get_bd_pins twoInMult_dds1_ampl1/data1_i]
connect_bd_net [get_bd_pins dds2_nco/dds_en_o] [get_bd_pins twoInMult_dds1_ampl1/data1_en_i] [get_bd_pins dds2_ampl/data_en_i]
connect_bd_net [get_bd_pins dds2_nco/dds_clk_o] [get_bd_pins twoInMult_dds1_ampl1/data1_clk_i] [get_bd_pins dds2_ampl/data_clk_i]
connect_bd_net [get_bd_pins twoInMult_dds1_ampl1/data_o] [get_bd_pins xlslice_dds2/Din]
connect_bd_net [get_bd_pins xlslice_dds2/Dout] [get_bd_pins dds2_offset/data_i]
connect_bd_net [get_bd_pins twoInMult_dds1_ampl1/data_en_o] [get_bd_pins dds2_offset/data_en_i]
connect_bd_net [get_bd_pins twoInMult_dds1_ampl1/data_clk_o] [get_bd_pins dds2_offset/data_clk_i]

# ---- address map ----
assign_bd_address -offset 0x43C00000 -range 64K -target_address_space [get_bd_addr_spaces processing_system7_0/Data] [get_bd_addr_segs adc1_offset/s00_axi/reg0]
assign_bd_address -offset 0x43C10000 -range 64K -target_address_space [get_bd_addr_spaces processing_system7_0/Data] [get_bd_addr_segs adc2_offset/s00_axi/reg0]
assign_bd_address -offset 0x43C20000 -range 64K -target_address_space [get_bd_addr_spaces processing_system7_0/Data] [get_bd_addr_segs dds1_ampl/s00_axi/reg0]
assign_bd_address -offset 0x43C30000 -range 64K -target_address_space [get_bd_addr_spaces processing_system7_0/Data] [get_bd_addr_segs dds1_f0/s00_axi/reg0]
assign_bd_address -offset 0x43C40000 -range 64K -target_address_space [get_bd_addr_spaces processing_system7_0/Data] [get_bd_addr_segs dds1_offset/s00_axi/reg0]
assign_bd_address -offset 0x43C50000 -range 64K -target_address_space [get_bd_addr_spaces processing_system7_0/Data] [get_bd_addr_segs dds1_range/s00_axi/reg0]
assign_bd_address -offset 0x43C60000 -range 64K -target_address_space [get_bd_addr_spaces processing_system7_0/Data] [get_bd_addr_segs pid1_kp/s00_axi/reg0]
assign_bd_address -offset 0x43C70000 -range 64K -target_address_space [get_bd_addr_spaces processing_system7_0/Data] [get_bd_addr_segs pid1_ki/s00_axi/reg0]
assign_bd_address -offset 0x43C80000 -range 64K -target_address_space [get_bd_addr_spaces processing_system7_0/Data] [get_bd_addr_segs pid1_kd/s00_axi/reg0]
assign_bd_address -offset 0x43C90000 -range 64K -target_address_space [get_bd_addr_spaces processing_system7_0/Data] [get_bd_addr_segs pid1_rst_int/s00_axi/reg0]
assign_bd_address -offset 0x43CA0000 -range 64K -target_address_space [get_bd_addr_spaces processing_system7_0/Data] [get_bd_addr_segs dds1_nco/s00_axi/reg0]
assign_bd_address -offset 0x43CB0000 -range 64K -target_address_space [get_bd_addr_spaces processing_system7_0/Data] [get_bd_addr_segs pid1_sign/s00_axi/reg0]
assign_bd_address -offset 0x43CC0000 -range 64K -target_address_space [get_bd_addr_spaces processing_system7_0/Data] [get_bd_addr_segs pid1_setpoint/s00_axi/reg0]
assign_bd_address -offset 0x43CD0000 -range 64K -target_address_space [get_bd_addr_spaces processing_system7_0/Data] [get_bd_addr_segs pid2_setpoint/s00_axi/reg0]
assign_bd_address -offset 0x43CE0000 -range 64K -target_address_space [get_bd_addr_spaces processing_system7_0/Data] [get_bd_addr_segs pid2_kp/s00_axi/reg0]
assign_bd_address -offset 0x43CF0000 -range 64K -target_address_space [get_bd_addr_spaces processing_system7_0/Data] [get_bd_addr_segs pid2_ki/s00_axi/reg0]
assign_bd_address -offset 0x43D00000 -range 64K -target_address_space [get_bd_addr_spaces processing_system7_0/Data] [get_bd_addr_segs pid2_sign/s00_axi/reg0]
assign_bd_address -offset 0x43D10000 -range 64K -target_address_space [get_bd_addr_spaces processing_system7_0/Data] [get_bd_addr_segs pid2_rst_int/s00_axi/reg0]
assign_bd_address -offset 0x43D20000 -range 64K -target_address_space [get_bd_addr_spaces processing_system7_0/Data] [get_bd_addr_segs pid2_kd/s00_axi/reg0]
assign_bd_address -offset 0x43D30000 -range 64K -target_address_space [get_bd_addr_spaces processing_system7_0/Data] [get_bd_addr_segs dds2_range/s00_axi/reg0]
assign_bd_address -offset 0x43D40000 -range 64K -target_address_space [get_bd_addr_spaces processing_system7_0/Data] [get_bd_addr_segs dds2_f0/s00_axi/reg0]
assign_bd_address -offset 0x43D50000 -range 64K -target_address_space [get_bd_addr_spaces processing_system7_0/Data] [get_bd_addr_segs dds2_nco/s00_axi/reg0]
assign_bd_address -offset 0x43D60000 -range 64K -target_address_space [get_bd_addr_spaces processing_system7_0/Data] [get_bd_addr_segs dds2_ampl/s00_axi/reg0]
assign_bd_address -offset 0x43D70000 -range 64K -target_address_space [get_bd_addr_spaces processing_system7_0/Data] [get_bd_addr_segs dds2_offset/s00_axi/reg0]

validate_bd_design
save_bd_design
